# Altium schematic sheet Sheet1.SchDoc
size A4
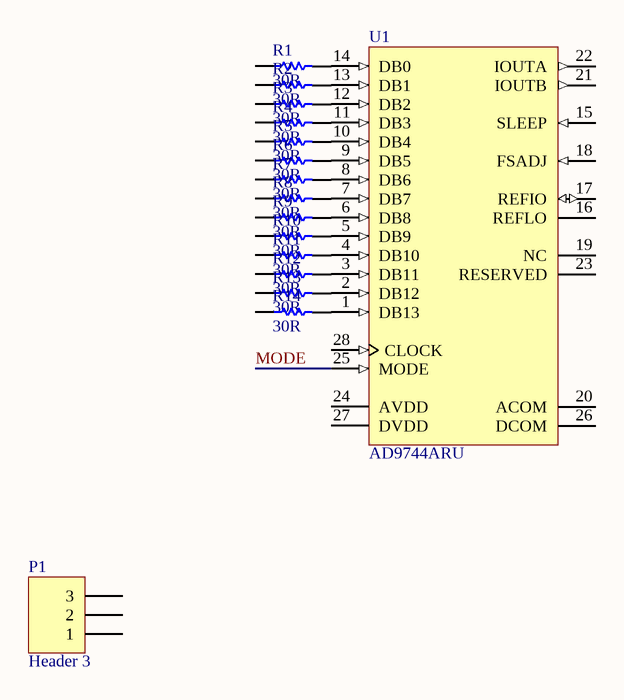
[diagram p0: Sheet1.SchDoc]

## Parts
P1  Header 3  [HDR1X3]
R1  30R  [0805]
R2  30R  [0805]
R3  30R  [0805]
R4  30R  [0805]
R5  30R  [0805]
R6  30R  [0805]
R7  30R  [0805]
R8  30R  [0805]
R9  30R  [0805]
R10  30R  [0805]
R11  30R  [0805]
R12  30R  [0805]
R13  30R  [0805]
R14  30R  [0805]
U1  AD9744ARU  [RU-28_N]

## Nets
MODE: U1.25(MODE)
NetR1_2: R1.2 U1.14(DB0)
NetR2_2: R2.2 U1.13(DB1)
NetR3_2: R3.2 U1.12(DB2)
NetR4_2: R4.2 U1.11(DB3)
NetR5_2: R5.2 U1.10(DB4)
NetR6_2: R6.2 U1.9(DB5)
NetR7_2: R7.2 U1.8(DB6)
NetR8_2: R8.2 U1.7(DB7)
NetR9_2: R9.2 U1.6(DB8)
NetR10_2: R10.2 U1.5(DB9)
NetR11_2: R11.2 U1.4(DB10)
NetR12_2: R12.2 U1.3(DB11)
NetR13_2: R13.2 U1.2(DB12)
NetR14_2: R14.2 U1.1(DB13)

Not connected (* = marked no-connect by the designer): P1 1 2 3; R1 1; R2 1; R3 1; R4 1; R5 1; R6 1; R7 1; R8 1; R9 1; R10 1; R11 1; R12 1; R13 1; R14 1; U1 15(SLEEP) 16(REFLO) 17(REFIO) 18(FSADJ) 19(NC) 20(ACOM) 21(IOUTB) 22(IOUTA) 23(RESERVED) 24(AVDD) 26(DCOM) 27(DVDD) 28(CLOCK)

## Library data of the parts
P1 = Header 3: Header, 3-Pin; LatestRevisionDate: 17-Jul-2002; LatestRevisionNote: Re-released for DXP Platform.; Publisher: Altium Limited
R1-R14 = Res
U1 = AD9744ARU: Single 14-Bit TxDAC, 210 Msps, -40 to +85 degC, RU-28, Tube; Generic Part Number: AD9744; Manufacturer: Analog Devices; # DAC Outputs: 1; Max V+: 3.6V; Op Pwr Diss: 145mW; Resolution (Bits): 14; Settling Time: 11ns; Single Supply: Yes; DatasheetVersion: Rev.B; PackageVersion: 2005; PackageReference: RU-28; PackageDescription: 28-Lead Thin Shrink Small Outline Package [TSSOP]; Packing: Tube; RoHS: N; Mounting Technology: Surface Mount; Code_JEDEC: MO-153-AE; PartNumber: AD9744ARU; ComponentLink1Description: Manufacturer URL; ComponentLink1URL: http://www.analog.com/en/index.html; ComponentLink2Description: Datasheet; ComponentLink2URL: http://www.analog.com/static/imported-files/data_sheets/AD9744.pdf; ComponentLink3Description: Package Specification; ComponentLink3URL: http://www.analog.com/static/imported-files/packages/249854663RU_28.pdf; ComponentLink4Description: Product URL; ComponentLink4URL: http://www.analog.com/en/digital-to-analog-converters/da-converters/ad9744/products/product.html